# EAGLE schematic V-00386-01 (EAGLE 7.2.0)
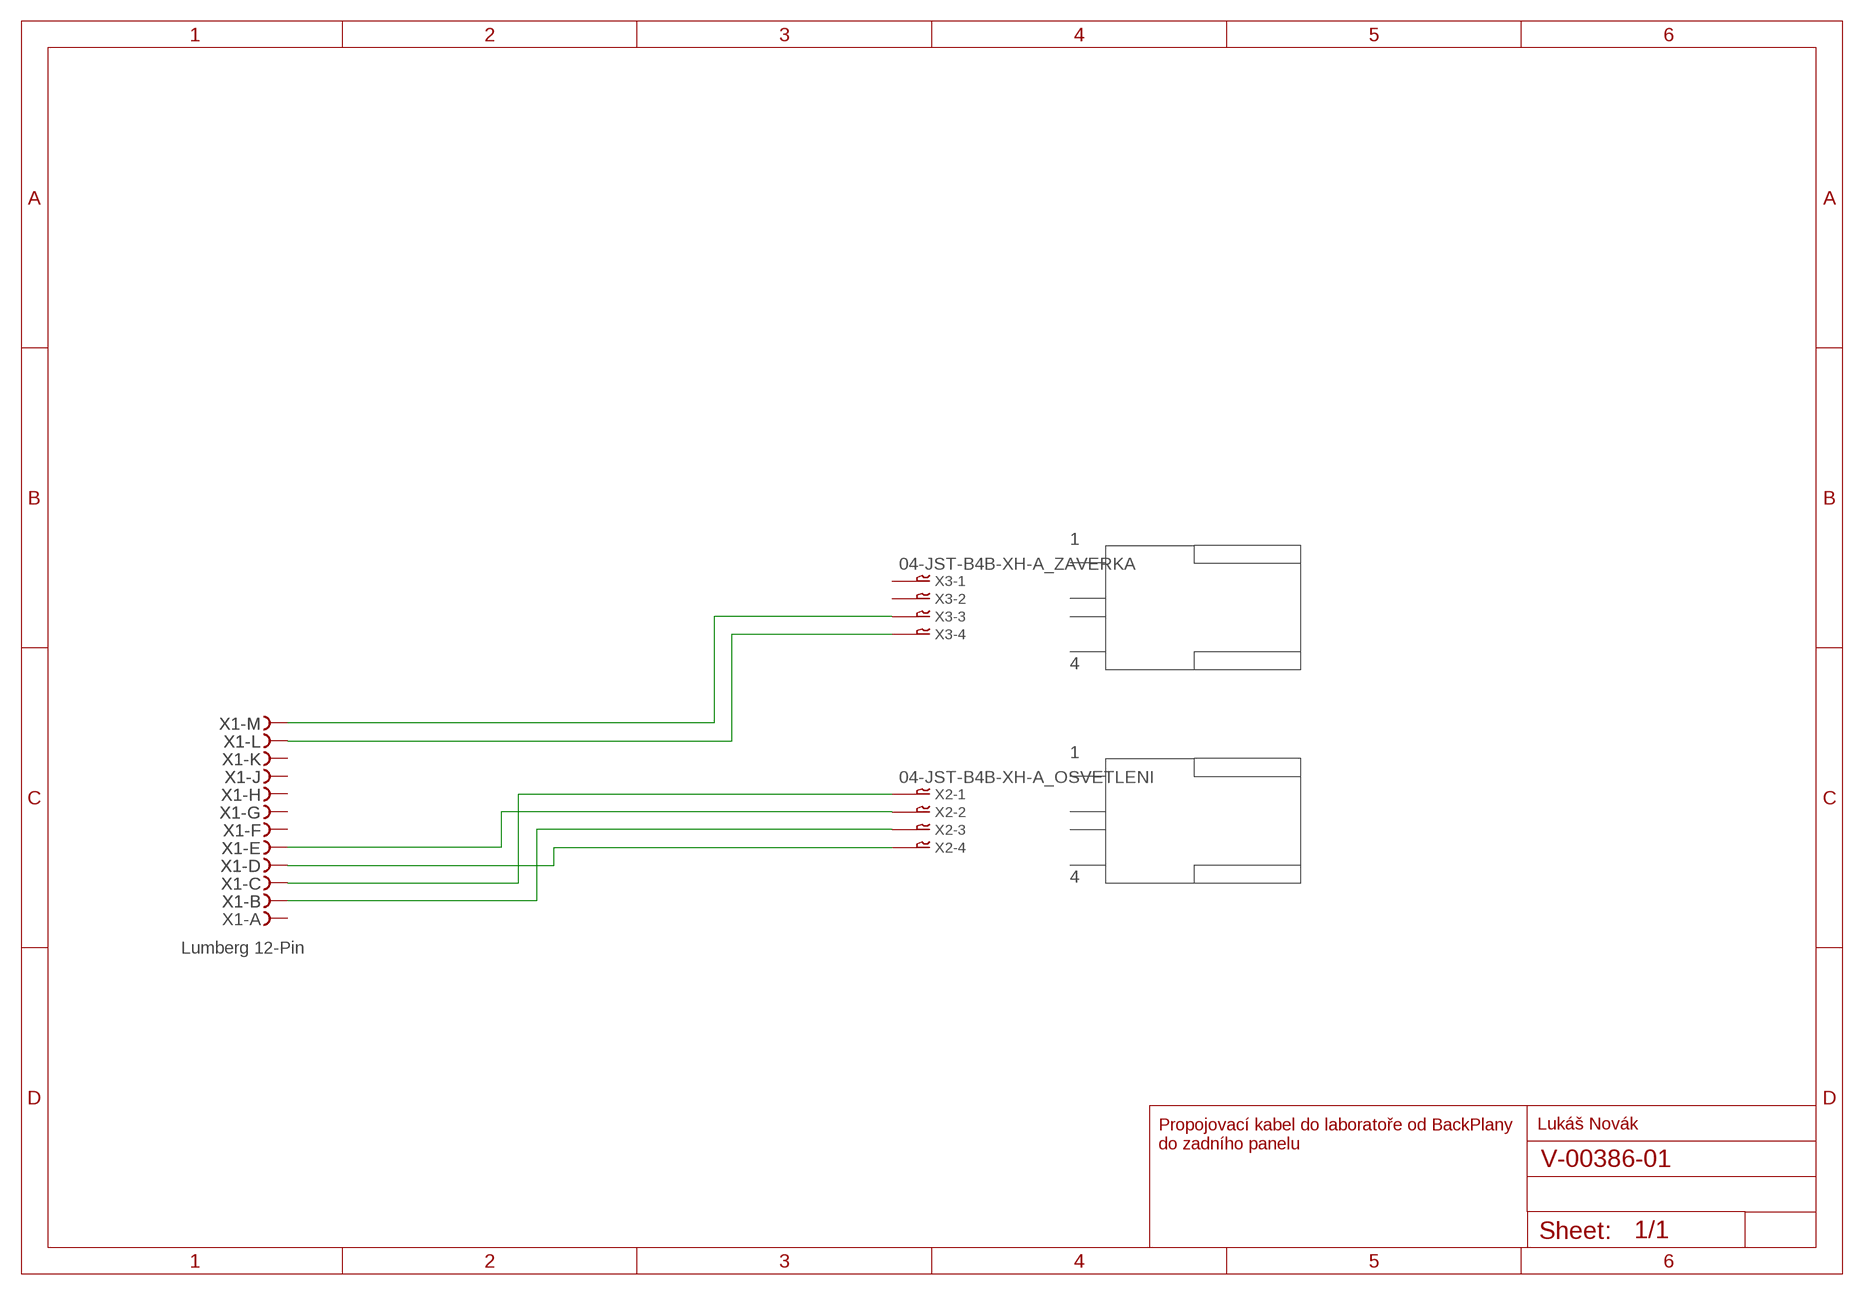
[diagram p0: schematic, sheet 1]

## Parts
X1  LU12MP  [LU12MP]
X2  04-JST-B4B-XH-A_OSVETLENI  04-JST-B4B-XH-A  [B4B-XH]
X3  04-JST-B4B-XH-A_ZAVERKA  04-JST-B4B-XH-A  [B4B-XH]

## Nets
N$1: X1.B X2.P$3
N$2: X1.C X2.P$1
N$3: X1.E X2.P$2
N$4: X1.D X2.P$4
N$5: X1.L X3.P$4
N$6: X1.M X3.P$3
Unconnected: X1.A X1.F X1.G X1.H X1.J X1.K X3.P$1 X3.P$2

## Notes on the sheet
- 1
- 4
- 1
- 4
- Lumberg 12-Pin
- Lukáš Novák
- Propojovací kabel do laboratoře od BackPlany
  do zadního panelu

## Library data of the parts
X1 = Kabely:LU12MP; LU: 12-Pin
X2 X3 = bt_con-jst-xh:04-JST: JST CONNECTOR